# Altium schematic sheet PV_MotorIO.SchDoc
size A
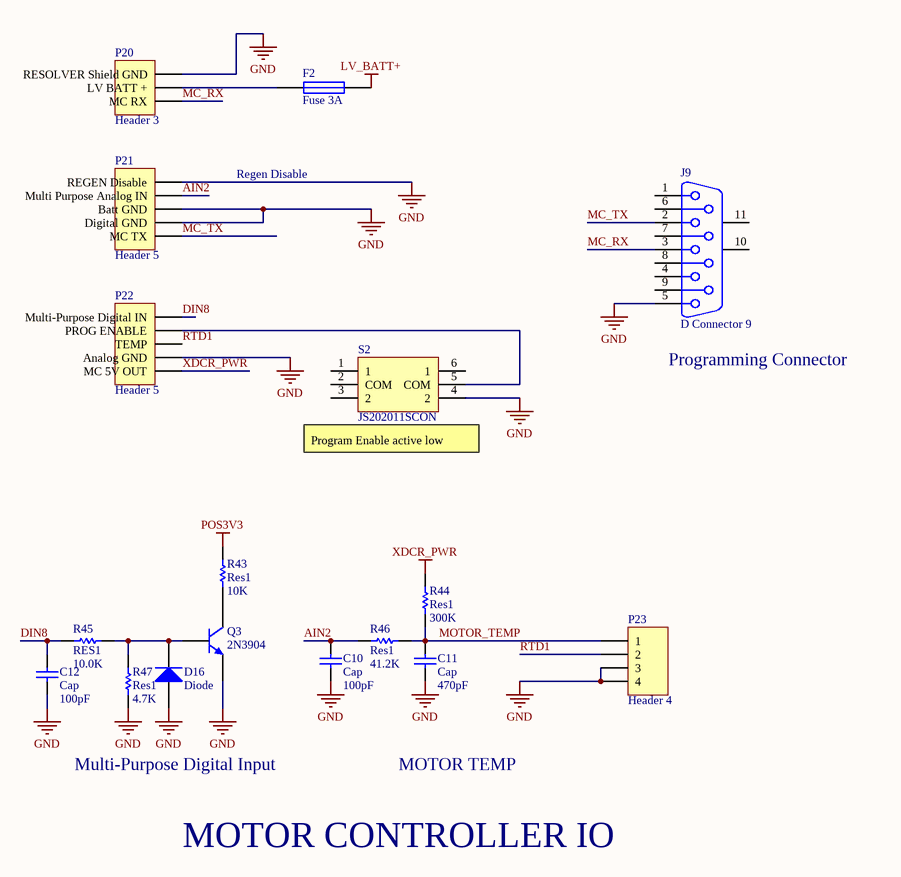
[diagram p0: PV_MotorIO.SchDoc]

## Parts
C10  Cap  value 100pF  [1206]
C11  Cap  value 470pF  [1206]
C12  Cap  value 100pF  [1206]
D16  Diode  [1206 DIODE]
F2  Fuse 3A  [1A FUSE HOLDER]
J9  D Connector 9  [DSUB1.385-2H9]
P20  Header 3  [3POS TERM BLOCK]
P21  Header 5  [5POS TERM BLOCK]
P22  Header 5  [5POS TERM BLOCK]
P23  Header 4  [4POS TERM BLOCK]
Q3  2N3904  [BJT]
R43  Res1  value 10K  [1206]
R44  Res1  value 300K  [1206]
R45  RES1  value 10.0K  [1206]
R46  Res1  value 41.2K  [1206]
R47  Res1  value 4.7K  [1206]
S2  JS202011SCON  [JS202011SCON]

## Nets
GND: C10.1 C11.1 C12.1 D16.1(A) J9.5 P20.3(RESOLVER_Shield_GND) P21.2(Digital_GND) P21.3(Batt_GND) P21.5(REGEN_Disable) P22.2(Analog_GND) P23.3 P23.4 Q3.1(E) R47.1 S2.4(2)
LV_BATT+: F2.2
POS3V3: R43.2
XDCR_PWR: P22.1(MC_5V_OUT) R44.2
AIN2: C10.2 P21.4(Multi_Purpose_Analog_IN) R46.2
DIN8: C12.2 P22.5(Multi-Purpose_Digital_IN) R45.1
MC_RX: J9.3 P20.1(MC_RX)
MC_TX: J9.2 P21.1(MC_TX)
MOTOR_TEMP: C11.2 P23.1 R44.1 R46.1
RTD1: P22.3(TEMP) P23.2
NetD16_2: D16.2(K) Q3.2(B) R45.2 R47.2
NetF2_1: F2.1 P20.2(LV_BATT_+)
NetP22_4: P22.4(PROG_ENABLE) S2.5(COM)
NetQ3_3: Q3.3(C) R43.1

Not connected (* = marked no-connect by the designer): J9 1 4 6 7 8 9 10(MH1) 11(MH2); S2 1 2(COM) 3(2) 6(1)

## Notes on the sheet
- Regen Disable
- (near J9) Programming Connector
- (near S2) Program Enable active low
- Multi-Purpose Digital Input
- MOTOR TEMP
- MOTOR CONTROLLER IO

## Library data of the parts
C10-C12 = Cap: Capacitor; Published: 8-Jun-2000; LatestRevisionDate: 17-Jul-2002; LatestRevisionNote: Re-released for DXP Platform.; PackageReference: RAD-0.3; Publisher: Altium Limited; PackageDescription: Radial Cap, Thru-Hole; 2 Leads; 0.3 in Pin Spacing
D16 = Diode: Default Diode; Published: 8-Jun-2000; LatestRevisionDate: 17-Jul-2002; LatestRevisionNote: Re-released for DXP Platform.; PackageVersion: Sep-1996; PackageReference: SMC; Publisher: Altium Limited; PackageDescription: DO-214-AB/SMC; 2 C-Bend Leads; Body 7.9 x 5.9 mm, inc. leads (LxW); Code_JEDEC: DO-214-AB
F2 = Fuse 1: Fuse; Published: 8-Jun-2000; LatestRevisionDate: 17-Jul-2002; LatestRevisionNote: Re-released for DXP Platform.; PackageReference: PIN-W2/E2.8; Publisher: Altium Limited; PackageDescription: Thru-Hole; 2 Leads; ComponentLink1Description: Digikey- FUSE; ComponentLink1URL: https://www.digikey.com/product-detail/en/littelfuse-inc/0451001.MRL/F2577CT-ND/813055; ComponentLink2Description: Digikey - Holder; ComponentLink2URL: https://www.digikey.com/product-detail/en/littelfuse-inc/0154001.DR/F1222TR-ND/183352
J9 = D Connector 9: Receptacle Assembly, 9 Position, Right Angle; PackageDocument: O; Positions: 9; Published: 15-Jun-2001; LatestRevisionDate: 17-Jul-2002; LatestRevisionNote: Re-released for DXP Platform.; DatasheetDocument: 1-Sep-1999; PackageReference: 788750; Publisher: Altium Limited; Orientation: Right Angle; Gender: Receptacle
P20 = Header 3: Header, 3-Pin; LatestRevisionDate: 17-Jul-2002; LatestRevisionNote: Re-released for DXP Platform.; Publisher: Altium Limited
P21 P22 = Header 5: Header, 5-Pin; LatestRevisionDate: 17-Jul-2002; LatestRevisionNote: Re-released for DXP Platform.; Publisher: Altium Limited
P23 = Header 4: Header, 4-Pin; LatestRevisionDate: 17-Jul-2002; LatestRevisionNote: Re-released for DXP Platform.; Publisher: Altium Limited
Q3 = 2N3904: NPN General Purpose Amplifier; Published: 8-Jun-2000; LatestRevisionDate: 15-Jan-2003; LatestRevisionNote: PCB Footprint 'BCY-W3/D4.7' replaced; DatasheetVersion: 1997; PackageVersion: Sep-1998; PackageReference: TO-92A; Publisher: Altium Limited; PackageDescription: TO, Flat Index; 3 In-Line, Axial Leads; Body Dia. 4.5mm; Leads 0.51 x 0.48 mm (max); ComponentLink1Description: Manufacturer Link; ComponentLink1URL: http://www.fairchildsemi.com/; ComponentLink2Description: Datasheet; ComponentLink2URL: http://www.mccsemi.com/up_pdf/2N3904(TO-92).pdf
R43-R47 = Res1: Resistor; Published: 8-Jun-2000; LatestRevisionDate: 17-Jul-2002; LatestRevisionNote: Re-released for DXP Platform.; PackageReference: AXIAL-0.3; Publisher: Altium Limited; PackageDescription: Axial Device, Thru-Hole; 2 Leads; 0.3 in Pin Spacing
S2 = JS202011SCON: DPST Switch; ComponentLink1Description: Digikey; ComponentLink1URL: https://www.digikey.com/product-detail/en/c-k/JS202011SCQN/401-2002-1-ND/1640098